# EAGLE design NeoDuino (EAGLE 9.1.0)
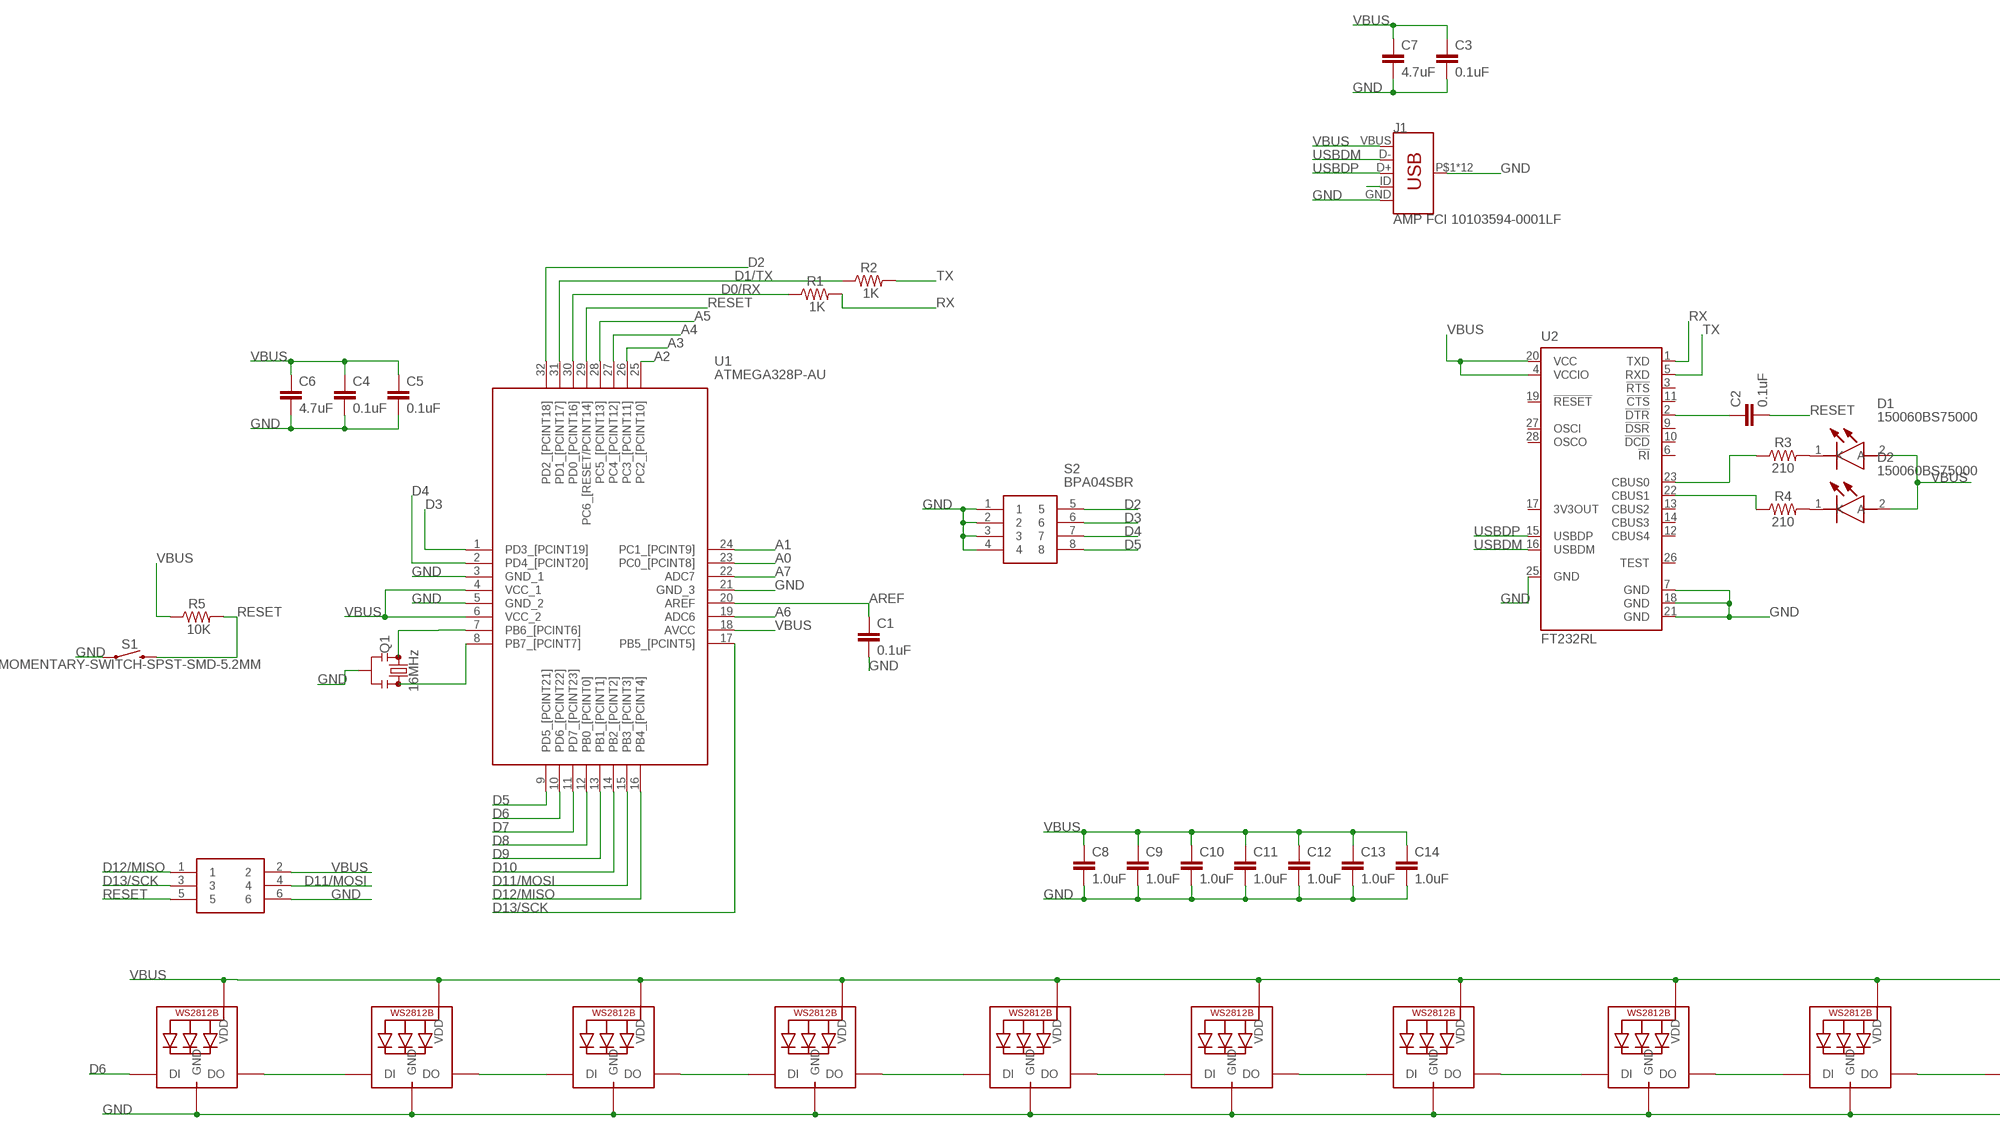
[diagram p0: schematic, sheet 1, part 1 of 2]
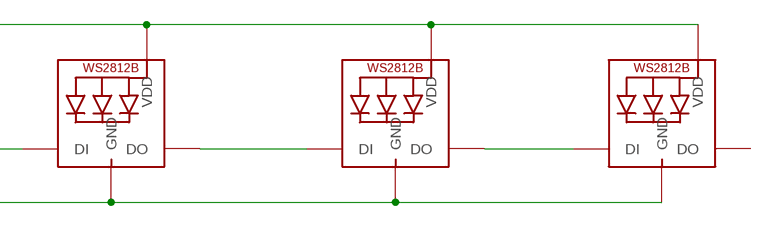
[diagram p1: schematic, sheet 1, part 2 of 2]

## Parts
C1  0.1uF  0.1UF-0402-16V-10%  [0402]
C2  0.1uF  0.1UF-0402-16V-10%  [0402]
C3  0.1uF  0.1UF-0402-16V-10%  [0402]
C4  0.1uF  0.1UF-0402-16V-10%  [0402]
C5  0.1uF  0.1UF-0402-16V-10%  [0402]
C6  4.7uF  4.7UF0603  [0603]
C7  4.7uF  4.7UF0603  [0603]
C8  1.0uF  1.0UF-0402-16V-10%  [0402]
C9  1.0uF  1.0UF-0402-16V-10%  [0402]
C10  1.0uF  1.0UF-0402-16V-10%  [0402]
C11  1.0uF  1.0UF-0402-16V-10%  [0402]
C12  1.0uF  1.0UF-0402-16V-10%  [0402]
C13  1.0uF  1.0UF-0402-16V-10%  [0402]
C14  1.0uF  1.0UF-0402-16V-10%  [0402]
D1  150060BS75000  [LEDC1608X80N]
D2  150060BS75000  [LEDC1608X80N]
D3  WS2812B5050  [WS2812B]
D4  WS2812B5050  [WS2812B]
D5  WS2812B5050  [WS2812B]
D6  WS2812B5050  [WS2812B]
D7  WS2812B5050  [WS2812B]
D8  WS2812B5050  [WS2812B]
D9  WS2812B5050  [WS2812B]
D10  WS2812B5050  [WS2812B]
D11  WS2812B5050  [WS2812B]
D12  WS2812B5050  [WS2812B]
D13  WS2812B5050  [WS2812B]
D14  WS2812B5050  [WS2812B]
J1  AMP FCI 10103594-0001LF  USB_MICRO-B_HALF_PTH  [USB-MICROB-PTH]
J2  TSM-103-01-L-DH  [TSM-103-01-L-DH]
Q1  16MHz  RESONATOR-16MHZSMD_3.2X1.3  [RESONATOR-SMD-3.2X1.3]
R1  1K  RESISTOR0402  [0402]
R2  1K  RESISTOR0402  [0402]
R3  210  RESISTOR0402  [0402]
R4  210  RESISTOR0402  [0402]
R5  10K  RESISTOR0402  [0402]
S1  MOMENTARY-SWITCH-SPST-SMD-5.2MM  [TACTILE_SWITCH_SMD_5.2MM]
S2  BPA04SBR  [BPA04SBR]
U1  ATMEGA328P-AU  [QFP80P900X900X120-32N]
U2  FT232RL  [SSOP28]

## Nets
A0: U1.23(PC0_[PCINT8])
A1: U1.24(PC1_[PCINT9])
A2: U1.25(PC2_[PCINT10])
A3: U1.26(PC3_[PCINT11])
A4: U1.27(PC4_[PCINT12])
A5: U1.28(PC5_[PCINT13])
A6: U1.19(ADC6)
A7: U1.22(ADC7)
AREF: C1.1 U1.20(AREF)
D0/RX: R1.1 U1.30(PD0_[PCINT16])
D1/TX: R2.1 U1.31(PD1_[PCINT17])
D2: S2.5 U1.32(PD2_[PCINT18])
D3: S2.6 U1.1(PD3_[PCINT19])
D4: S2.7 U1.2(PD4_[PCINT20])
D5: S2.8 U1.9(PD5_[PCINT21])
D6: D3.4-DIN(DI) U1.10(PD6_[PCINT22])
D7: U1.11(PD7_[PCINT23])
D8: U1.12(PB0_[PCINT0])
D9: U1.13(PB1_[PCINT1])
D10: U1.14(PB2_[PCINT2])
D11/MOSI: J2.4 U1.15(PB3_[PCINT3])
D12/MISO: J2.1 U1.16(PB4_[PCINT4])
D13/SCK: J2.3 U1.17(PB5_[PCINT5])
GND: C1.2 C3.2 C4.2 C5.2 C6.2 C7.2 C8.2 C9.2 C10.2 C11.2 C12.2 C13.2 C14.2 D3.3-GND(GND) D4.3-GND(GND) D5.3-GND(GND) D6.3-GND(GND) D7.3-GND(GND) D8.3-GND(GND) D9.3-GND(GND) D10.3-GND(GND) D11.3-GND(GND) D12.3-GND(GND) D13.3-GND(GND) D14.3-GND(GND) J1.GND J1.P$1(SHIELD) J1.P$2(SHIELD) J1.P$3(SHIELD) J1.P$4(SHIELD) J1.P$6(SHIELD) J1.P$8(SHIELD) J1.P$10(SHIELD) J1.P$12(SHIELD) J1.SHEILD2(SHIELD) J1.SHIELD J1.SHIELD3(SHIELD) J1.SHIELD4(SHIELD) J2.6 Q1.2 S1.1 S2.1 S2.2 S2.3 S2.4 U1.3(GND_1) U1.5(GND_2) U1.21(GND_3) U2.7(GND) U2.18(GND) U2.21(GND) U2.25(GND)
N$1: Q1.3 U1.8(PB7_[PCINT7])
N$2: C2.1 U2.2(!DTR)
N$3: R3.1 U2.23(CBUS0)
N$4: Q1.1 U1.7(PB6_[PCINT6])
N$5: J1.ID
N$6: D1.1(K) R3.2
N$7: D2.1(K) R4.2
N$9: R4.1 U2.22(CBUS1)
N$10: D5.2-DOUT(DO) D6.4-DIN(DI)
N$11: D4.2-DOUT(DO) D5.4-DIN(DI)
N$12: D3.2-DOUT(DO) D4.4-DIN(DI)
N$13: D8.2-DOUT(DO) D9.4-DIN(DI)
N$14: D11.2-DOUT(DO) D12.4-DIN(DI)
N$15: D7.2-DOUT(DO) D8.4-DIN(DI)
N$16: D6.2-DOUT(DO) D7.4-DIN(DI)
N$17: D10.2-DOUT(DO) D11.4-DIN(DI)
N$18: D9.2-DOUT(DO) D10.4-DIN(DI)
N$19: D13.2-DOUT(DO) D14.4-DIN(DI)
N$20: D12.2-DOUT(DO) D13.4-DIN(DI)
RESET: C2.2 J2.5 R5.2 S1.3 U1.29(PC6_[RESET/PCINT14])
RX: R1.2 U2.1(TXD)
TX: R2.2 U2.5(RXD)
USBDM: J1.D- U2.16(USBDM)
USBDP: J1.D+ U2.15(USBDP)
VBUS: C3.1 C4.1 C5.1 C6.1 C7.1 C8.1 C9.1 C10.1 C11.1 C12.1 C13.1 C14.1 D1.2(A) D2.2(A) D3.1-VDD(VDD) D4.1-VDD(VDD) D5.1-VDD(VDD) D6.1-VDD(VDD) D7.1-VDD(VDD) D8.1-VDD(VDD) D9.1-VDD(VDD) D10.1-VDD(VDD) D11.1-VDD(VDD) D12.1-VDD(VDD) D13.1-VDD(VDD) D14.1-VDD(VDD) J1.VBUS J2.2 R5.1 U1.4(VCC_1) U1.6(VCC_2) U1.18(AVCC) U2.4(VCCIO) U2.20(VCC)
Unconnected: D14.2-DOUT(DO) U2.3(!RTS) U2.6(!RI) U2.9(!DSR) U2.10(!DCD) U2.11(!CTS) U2.12(CBUS4) U2.13(CBUS2) U2.14(CBUS3) U2.17(3V3OUT) U2.19(!RESET) U2.26(TEST) U2.27(OSCI) U2.28(OSCO)

## Library data of the parts
C1-C5 = SparkFun-Capacitors:0.1UF: 0.1µF ceramic capacitors A capacitor is a passive two-terminal electrical component used to store electrical energy temporarily in an electric field.; PROD_ID: CAP-12416
C6 C7 = SparkFun-Capacitors:4.7UF: 4.7µF ceramic capacitors A capacitor is a passive two-terminal electrical component used to store electrical energy temporarily in an electric field.; PROD_ID: CAP-08280
C8-C14 = SparkFun-Capacitors:1.0UF: 1µF ceramic capacitors A capacitor is a passive two-terminal electrical component used to store electrical energy temporarily in an electric field.; PROD_ID: CAP-12417
D1 D2 = MitchellLibrary:150060BS75000: LED,Wurth Elektronik,150060BS75000 Wurth Elektronik 150060BS75000, WL-SMCW Series Blue LED, 470 nm 1608 (0603) Clear, Rectangle Lens SMD package Source: Datasheet <https://componentsearchengine.com/Datasheets/2/150060BS75000.pdf>; ARROW_PART_NUMBER: 150060BS75000; ARROW_PRICE-STOCK: http://uk.rs-online.com/web/p/products/1623738; DESCRIPTION: LED,Wurth Elektronik,150060BS75000 Wurth Elektronik 150060BS75000, WL-SMCW Series Blue LED, 470 nm 1608 (0603) Clear, Rectangle Lens SMD package; HEIGHT: 0.8mm; MANUFACTURER_NAME: Wurth Elektronik; MANUFACTURER_PART_NUMBER: 150060BS75000; RS_PART_NUMBER: 1623738; RS_PRICE-STOCK: http://uk.rs-online.com/web/p/products/1623738
D3-D14 = adafruit:WS2812B
J1 = SparkFun-Connectors:USB_MICRO-B: USB Type Micro-B Connector Male/female and PTH/SMT variants SparkFun Products: SparkFun microB USB Breakout <https://www.sparkfun.com/products/12035> SparkFun USB microB Plug Breakout <https://www.sparkfun.com/products/10031> SparkFun ESP8266 Thing <https://www.sparkfun.com/products/13231>; PROD_ID: CONN-13711
J2 = MitchellLibrary:TSM-103-01-L-DH
Q1 = SparkFun-Clocks:RESONATOR-16MHZ: 16MHz Resonator Digikey Example <http://www.digikey.com/product-detail/en/murata-electronics-north-america/CSTCE16M0V53-R0/490-1198-1-ND/584635> Frequency: 16MHz Frequency Stability: ±0.3% Frequency Tolerance: ±0.5% Capacitance: 15pF SparkFun Products SparkFun OpenLog <https://www.sparkfun.com/products/13712> SparkFun MicroView - OLED Arduino Module <https://www.sparkfun.com/products/12923>; PROD_ID: XTAL-08900
R1-R5 = SparkFun-Resistors:RESISTOR: Generic Resistor Package
S1 = SparkFun-Switches:MOMENTARY-SWITCH-SPST: Momentary Switch (Pushbutton) - SPST Normally-open (NO) SPST momentary switches (buttons, pushbuttons). Variants PTH-12MM - 12mm square, through-hole Momentary Pushbutton Switch - 12mm Square <https://www.sparkfun.com/products/9190> (COM-09190) PTH-6.0MM, PTH-6.0MM-KIT - 6.0mm square, through-hole Mini Pushbutton Switch <https://www.sparkfun.com/products/97> (COM-00097) KIT package intended for soldering kit's - only one side of pads' copper is exposed. PTH-RIGHT-ANGLE-KIT - Right-angle, through-hole Right Angle Tactile Button <https://www.sparkfun.com/products/10791> - Used on SparkFun BigTime Watch Kit <https://www.sparkfun.com/products/11734> SMD-12MM - 12mm square, surface-mount Tactile Button - SMD (12mm) <https://www.sparkfun.com/products/12993> (COM-12993) Used on SparkFun PicoBoard <https://www.sparkfun.com/products/11888> SMD-4.5MM - 4.5mm Square Trackball Switch Used on SparkFun Blackberry Trackballer Breakout <https://www.sparkfun.com/products/13169> SMD-4.6MMX2.8MM - 4.60mm x 2.80mm, surface mount Used on SparkFun SAMD21 Mini Breakout <https://www.sparkfun.com/products/13664> SMD-5.2MM, SMD-5.2-REDUNDANT - 5.2mm square, surface-mount Mini Pushbutton Switch - SMD <https://www.sparkfun.com/products/8720> (COM-08720) Used on Arduino Pro Mini <https://www.sparkfun.com/products/11114> REDUNDANT package connects both switch circuits together SMD-6.0X3.5MM - 6.0 x 3.5mm, surface mount Momentary Reset Switch SMD <https://www.sparkfun.com/products/8229> (COM-08229) SMD-6.2MM-TALL - 6.2mm square, surface mount Tactile Button - SMD (6mm) <https://www.sparkfun.com/products/12992> Used on SparkFun Digital Sandbox <https://www.sparkfun.com/products/12651> SMD-RIGHT-ANGLE - Right-angle, surface mount Used on SparkFun Block for Intel® Edison - Arduino <https://www.sparkfun.com/products/13036>; PROD_ID: SWCH-08247; SF_SKU: COM-08720
S2 = MitchellLibrary:BPA04SBR: 4 Way Surface Mount DIP Switch SPST, Side Actuator Source: Datasheet <https://www.ckswitches.com/media/1332/bpa.pdf>; ARROW_PART_NUMBER: BPA04SBR; ARROW_PRICE-STOCK: https://www.arrow.com/en/products/bpa04sbr/ck; DESCRIPTION: 4 Way Surface Mount DIP Switch SPST, Side Actuator; HEIGHT: 7mm; MANUFACTURER_NAME: C & K COMPONENTS; MANUFACTURER_PART_NUMBER: BPA04SBR; RS_PART_NUMBER: 7931557P; RS_PRICE-STOCK: http://uk.rs-online.com/web/p/products/7931557P
U1 = MitchellLibrary:ATMEGA328P-AU: MICROCHIP - ATMEGA328P-AU. - MICROCONTROLLER MCU, 8 BIT, ATMEGA, 20MHZ, TQFP-32 Source: Datasheet <https://componentsearchengine.com/Datasheets/2/ATMEGA328P-AU.pdf>; ARROW_PART_NUMBER: ATMEGA328P-AU; ARROW_PRICE-STOCK: https://www.arrow.com/en/products/atmega328p-au/microchip-technology; DESCRIPTION: MICROCHIP - ATMEGA328P-AU. - MICROCONTROLLER MCU, 8 BIT, ATMEGA, 20MHZ, TQFP-32; HEIGHT: 1.2mm; MANUFACTURER_NAME: Microchip; MANUFACTURER_PART_NUMBER: ATMEGA328P-AU; RS_PART_NUMBER: 1310271; RS_PRICE-STOCK: http://uk.rs-online.com/web/p/products/1310271
U2 = ftdichip:FT232R: Source: http://www.ftdichip.com/Documents/DataSheets/DS_FT232R_v104.pdf; MPN: FT232RL; OC_FARNELL: 1146032; OC_NEWARK: 91K9918

## Board
PCB Matrix Packages
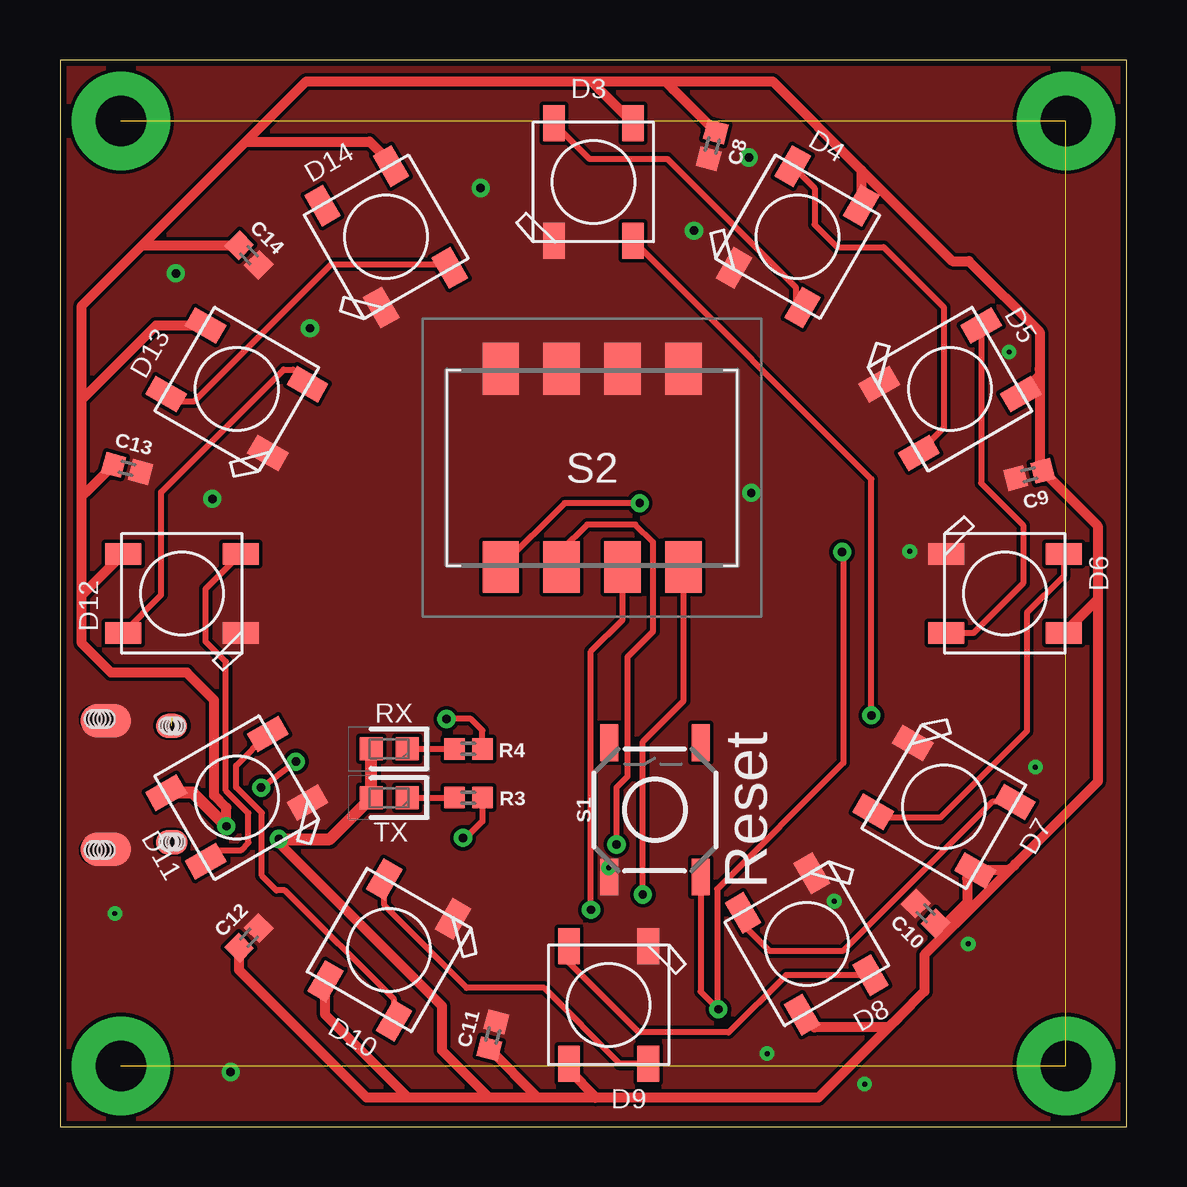
[diagram p2: board, top side]
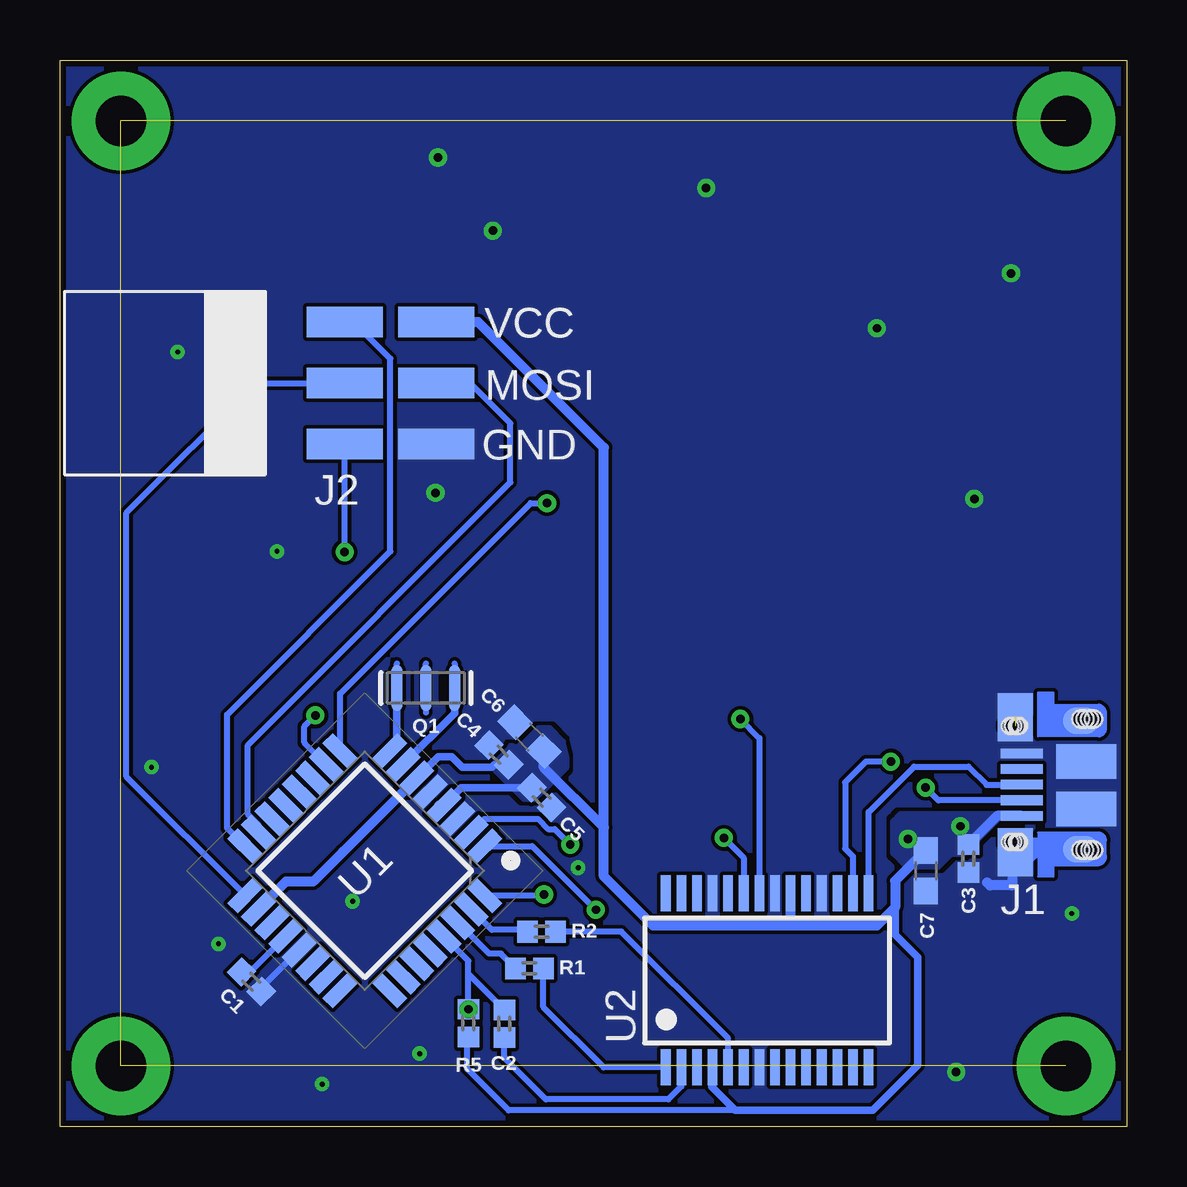
[diagram p3: board, bottom side, seen from below]

Size 44.45 x 44.45 mm. Coordinates in mm from the lower left corner, seen from the top.
Outline: 0,0 44.45,0 44.45,44.45 0,44.45 0,0
Copper layers (1*16): Top 0.035mm / dielectric 1.5mm / Bottom 0.035mm
Design rules "default *": minimum track width 6mil, minimum drill 0.35mm, track to track 6mil, track to pad 6mil, pad to pad 6mil, via to via 6mil, smd to smd 6mil, copper to edge 10mil, drill to drill 6mil, minimum pad ring 10mil, minimum via ring 8mil, stop-mask expansion 4mil, vias tented up to drill 0mil, thermal gap 10mil

### Footprints (pad centres in the part's own frame; a part is rotated, then mirrored left to right if it is on the bottom)
0402 = smd 0.85 x 0.9: 1 -0.58,0; 2 0.58,0
0603 = smd 1.1 x 1: 1 -0.85,0; 2 0.85,0
LEDC1608X80N = smd 0.95 x 0.95: 1 -0.75,0; 2 0.75,0
WS2812B = smd 1.5 x 0.9: 1-VDD 2.45,-1.65; 2-DOUT 2.45,1.65; 3-GND -2.45,1.65; 4-DIN -2.45,-1.65
USB-MICROB-PTH = smd 0.4 x 1.75: D+ 0.031,1.331; D- -0.619,1.331; GND 1.331,1.331; ID 0.681,1.331; VBUS -1.269,1.331 | smd 1.4 x 2.1 bottom: P$1 2.701,-1.142; P$3 -2.659,-1.144 | smd 1 x 1.3: P$2 2.487,1.594; P$6 -2.368,1.604 | smd 1 x 1.3 bottom: P$4 -2.368,1.604; P$10 2.481,1.598 | smd 1.1 x 1.5: P$8 2.701,-1.142; P$12 -2.659,-1.144 | smd 2 x 1.46: SHEILD2 2.831,1.606; SHIELD -2.794,1.606 | smd 1.425 x 2.5: SHIELD3 -0.979,-1.349; SHIELD4 0.996,-1.352 | hole 0.7: -2.693,-1.134; -2.693,-1.3; -2.694,-1.499; -2.694,-1.664; 2.768,-1.134; 2.767,-1.303; 2.766,-1.496; 2.766,-1.664 | hole 0.66: -2.359,1.821; -2.349,1.691; -2.359,1.541; -2.354,1.432; 2.481,1.821; 2.491,1.691; 2.481,1.541; 2.486,1.432
TSM-103-01-L-DH = smd 1.27 x 3.175: 1 0,0; 2 0,3.81; 3 2.54,0; 4 2.54,3.81; 5 5.08,0; 6 5.08,3.81
RESONATOR-SMD-3.2X1.3 = smd 0.45 x 1.905: 1 -1.2,0; 2 0,0; 3 1.2,0
TACTILE_SWITCH_SMD_5.2MM = smd 1.524 x 0.762: 1 -2.794,1.905; 2 2.794,1.905; 3 -2.794,-1.905; 4 2.794,-1.905
BPA04SBR = smd 1.52 x 2.15: 1 -3.81,-4.13; 2 -1.27,-4.13; 3 1.27,-4.13; 4 3.81,-4.13; 5 -3.81,4.13; 6 -1.27,4.13; 7 1.27,4.13; 8 3.81,4.13
QFP80P900X900X120-32N = smd 1.5 x 0.6: 1 -4.25,2.8; 2 -4.25,2; 3 -4.25,1.2; 4 -4.25,0.4; 5 -4.25,-0.4; 6 -4.25,-1.2; 7 -4.25,-2; 8 -4.25,-2.8; 17 4.25,-2.8; 18 4.25,-2; 19 4.25,-1.2; 20 4.25,-0.4; 21 4.25,0.4; 22 4.25,1.2; 23 4.25,2; 24 4.25,2.8 | smd 0.6 x 1.5: 9 -2.8,-4.25; 10 -2,-4.25; 11 -1.2,-4.25; 12 -0.4,-4.25; 13 0.4,-4.25; 14 1.2,-4.25; 15 2,-4.25; 16 2.8,-4.25; 25 2.8,4.25; 26 2,4.25; 27 1.2,4.25; 28 0.4,4.25; 29 -0.4,4.25; 30 -1.2,4.25; 31 -2,4.25; 32 -2.8,4.25
SSOP28 = smd 0.4 x 1.5: 1 -4.225,-3.625; 2 -3.575,-3.625; 3 -2.925,-3.625; 4 -2.275,-3.625; 5 -1.625,-3.625; 6 -0.975,-3.625; 7 -0.325,-3.625; 8 0.325,-3.625; 9 0.975,-3.625; 10 1.625,-3.625; 11 2.275,-3.625; 12 2.925,-3.625; 13 3.575,-3.625; 14 4.225,-3.625; 15 4.225,3.625; 16 3.575,3.625; 17 2.925,3.625; 18 2.275,3.625; 19 1.625,3.625; 20 0.975,3.625; 21 0.325,3.625; 22 -0.325,3.625; 23 -0.975,3.625; 24 -1.625,3.625; 25 -2.275,3.625; 26 -2.925,3.625; 27 -3.575,3.625; 28 -4.225,3.625

### Placement (x,y rotation side)
C1  36.47,6.05 315 bottom
C2  25.93,4.29 90 bottom
C3  6.6,11.18 270 bottom
C4  26.16,15.49 135 bottom
C5  24.38,13.72 315 bottom
C6  24.89,16.26 135 bottom
C7  8.38,10.67 270 bottom
C8  27.18,40.89 255 top
C9  40.39,27.18 195 top
C10  36.07,8.89 135 top
C11  18.03,3.81 75 top
C12  7.87,7.87 45 top
C13  2.79,27.43 345 top
C14  7.87,36.32 315 top
D1  13.72,13.72 180 top
D2  13.72,15.75 180 top
D3  22.23,39.37 90 top
D4  30.73,37.08 60 top
D5  37.08,30.73 30 top
D6  39.37,22.23 0 top
D7  36.83,13.34 330 top
D8  31.11,7.62 300 top
D9  22.86,5.08 270 top
D10  13.72,7.37 240 top
D11  7.37,13.72 210 top
D12  5.08,22.23 180 top
D13  7.37,30.73 150 top
D14  13.59,37.08 120 top
J1  3.05,14.22 90 bottom
J2  32.59,33.53 270 bottom
Q1  29.21,18.29 180 bottom
R1  24.89,6.6 0 bottom
R2  24.38,8.13 0 bottom
R3  17.02,13.72 180 top
R4  17.02,15.75 180 top
R5  27.43,4.32 90 bottom
S1  24.79,13.21 90 top
S2  22.17,27.46 180 top
U1  31.75,10.67 225 bottom
U2  14.99,6.1 0 bottom

### Tracks (layer width: path | path; a pad name or v marks a point on that pad's centre or on a via)
AREF
  Bottom 0.254: C1.1 36.53,6.46 U1.20
D0/RX
  Bottom 0.254: R1.1 26.08,7.21 26.57,7.21 27.87,8.51 U1.30
D1/TX
  Bottom 0.254: R2.1 25.04,8.2 26.46,8.2 U1.31
D2  (via drill 0.35)
  Top 0.254: v24.28,9.68 24.28,16.05 25.98,17.75 S2.5
  Bottom 0.254: U1.32 24.32,9.64 v24.28,9.68
D3  (via drill 0.35)
  Top 0.254: v22.12,9.04 22.12,19.81 23.44,21.13 S2.6
  Bottom 0.254: U1.1 24.77,11.69 v22.12,9.04
D4  (via drill 0.35)
  Top 0.254: v23.19,11.76 23.19,14.15 23.65,14.61 23.65,19.58 24.71,20.65 24.71,24.36 23.98,25.09 21.96,25.09 20.9,24.04 S2.7
  Bottom 0.254: U1.2 26.76,12.83 24.53,12.83 24.11,12.41 23.84,12.41 v23.19,11.76
D5  (via drill 0.35)
  Top 0.254: v24.16,25.98 21.02,25.98 S2.8
  Bottom 0.254: U1.9 32.77,18.05 24.84,25.98 v24.16,25.98
D6  (via drill 0.35)
  Top 0.254: v33.81,17.14 33.81,26.99 D3.4-DIN
  Bottom 0.254: U1.10 34.27,16.01 34.27,16.69 v33.81,17.14
D11/MOSI
  Bottom 0.254: U1.15 36.17,12.57 36.63,13.03 36.63,15.9 25.68,26.85 25.68,29.31 27.36,30.99 J2.4
D12/MISO
  Bottom 0.254: U1.16 37.49,12.45 37.49,17.17 30.68,23.98 30.68,32 32.21,33.53 J2.1
D13/SCK
  Bottom 0.254: U1.17 41.68,14.59 41.68,25.58 36.27,30.99 J2.3
GND  (via drill 0.2 pad 0.41, 0.35)  (3 unrouted)
  Bottom 0.254: C1.2 36.06,5.79 U1.21
  Bottom 0.406: J1.P$6 3.51,11.86 3.38,11.99 3.69,11.67 3.69,11.54 4.16,11.08 4.29,11.08 4.78,10.59 4.78,10.06 5.69,10.06 5.82,10.19
  other vias: 28.8,26.42 26.42,37.34 28.7,40.39 17.53,39.12 10.41,33.27 6.35,26.16 4.83,35.56 2.29,8.89 7.11,2.29 29.46,3.05 33.53,1.78 37.85,7.62 32.26,9.4 40.64,14.99 35.41,23.98 39.55,32.28 22.86,10.79
  pour Bottom (rank 2, no thermals): 0,0 0,44.45 44.45,44.45 44.45,0
  pour Top (rank 2, no thermals): 0,0 0,44.2 0.25,44.45 44.45,44.45 44.45,0 37.85,0 37.59,-0.25
N$1
  Bottom 0.305: Q1.3 30.41,15.97 U1.8
N$2
  Bottom 0.254: U2.2 18.56,1.68 19.1,1.14 24.21,1.14 25.96,2.9 25.93,2.92 C2.1
N$3  (via drill 0.35)
  Top 0.254: R3.1 17.6,12.73 17.6,12.72 16.92,12.04 v16.79,12.04
  Bottom 0.254: v16.79,12.04 15.96,11.21 U2.23
N$4
  Bottom 0.305: Q1.1 28.01,17.24 U1.7
N$6
  Top 0.254: D1.1 R3.2
N$7
  Top 0.254: D2.1 R4.2
N$8  (via drill 2.1 pad 4.1)  (3 unrouted)
  other vias: 2.54,2.54 41.91,2.54 41.91,41.91 2.54,41.91
N$9  (via drill 0.35)
  Top 0.254: 17.62,15.77 R4.1 17.6,16.51 17.12,16.99 v16.1,16.99
  Bottom 0.254: v16.1,16.99 15.31,16.2 U2.22
N$10
  Top 0.254: D5.2-DOUT 38.38,26.82 40.13,25.07 40.13,22.66 38.05,20.57 D6.4-DIN
N$11
  Top 0.254: D4.2-DOUT 31.45,39.12 31.45,37.59 32.38,36.65 34.31,36.65 36.83,34.14 36.83,29.12 D5.4-DIN
N$12
  Top 0.254: D3.2-DOUT 22.06,40.34 25.3,40.34 30.66,34.98 30.66,34.42 D4.4-DIN
N$13
  Top 0.254: D8.2-DOUT 30.25,6.32 27.86,3.94 24.11,3.94 21.21,6.83 D9.4-DIN
N$14
  Top 0.254: D11.2-DOUT 6.54,11.53 7.54,11.53 7.85,11.84 7.85,13.06 6.91,14.01 6.91,19.38 6.07,20.22 6.07,22.42 D12.4-DIN
N$15
  Top 0.254: D7.2-DOUT 38.84,13.54 32.61,7.32 29.57,7.32 28.46,8.42 D8.4-DIN
N$16
  Top 0.254: D6.2-DOUT 41.82,22.95 40.28,21.41 40.28,16.48 36.68,12.88 34.14,12.88 D7.4-DIN
N$17
  Top 0.254: D10.2-DOUT 13.92,5.31 9.37,9.86 9.02,9.86 8.41,10.46 8.41,13.08 7.34,14.15 7.34,15.05 D11.4-DIN
N$18
  Top 0.254: D9.2-DOUT 23.33,2.63 20.17,5.79 16.94,5.79 13.51,9.22 D10.4-DIN
N$19
  Top 0.254: D14.4-DIN 16.09,35.94 11.3,35.94 5.59,30.23 4.72,30.23 D13.2-DOUT
N$20
  Top 0.254: D12.2-DOUT 4.22,22.16 4.22,26.44 9.32,31.55 9.7,31.55 D13.4-DIN
RESET  (via drill 0.35)
  Top 0.254: S1.3 26.7,5.63 R5.2 27.38,4.95 27.38,9.91 32.64,15.16 32.64,23.9 v32.59,23.95
  Bottom 0.254: R5.2 27.43,6.92 | 27.43,6.92 U1.29 | C2.2 27.43,6.37 27.43,6.92 | v32.59,23.95 J2.5
  other vias: 27.43,4.9
RX
  Bottom 0.254: U2.1 21.8,2.47 24.31,4.98 R1.2
TX
  Bottom 0.254: U2.5 16.61,3.68 21.06,8.13 R2.2
USBDM  (via drill 0.35)
  Top 0.254: v8.38,14.13 v8.39,14.13 v9.83,15.21
  Bottom 0.254: U2.16 11.41,11.27 11.73,11.6 11.73,14.35 10.87,15.21 v9.83,15.21 | J1.D- 7.86,13.61 v8.38,14.13
USBDP
  Bottom 0.254: U2.15 10.76,13.12 8.87,15.01 6.6,15.01 5.84,14.25 J1.D+
VBUS  (via drill 0.35)
  Top 0.406: v6.93,12.52 6.93,13.3 6.43,13.8 6.43,17.78 5.28,18.92 2.13,18.92 0.91,20.14 0.91,22.16 | D12.1-VDD 1.22,22.46 0.94,22.18 0.91,22.16 | D14.1-VDD 13.79,40.16 12.9,41.05 7.75,41.05 | D3.1-VDD 22.46,43.23 22.13,43.56 | 22.13,43.56 25.22,43.56 | C8.1 25.55,43.23 25.22,43.56 | 25.22,43.56 29.69,43.56 33.39,39.87 | 33.39,39.87 D4.1-VDD | 33.39,39.87 37.19,36.07 37.87,36.07 40.82,33.12 40.82,31.57 | D5.1-VDD 40.82,31.32 40.82,31.57 | 40.82,31.57 40.82,27.46 C9.1 43.23,25.04 43.23,21.99 | 43.23,21.99 D6.1-VDD | 43.23,21.99 43.23,14.38 39.8,10.95 | 39.8,10.95 39.53,10.68 D7.1-VDD 37.8,10.35 37.8,9.35 36.93,8.48 C10.1 37.33,8.48 39.8,10.95 | 39.8,10.95 36.02,7.16 36.02,5.64 34.95,4.57 | 34.95,4.57 34.52,4.14 31.44,4.14 D8.1-VDD | 34.95,4.57 31.6,1.22 22.35,1.22 | 22.35,1.22 22.25,1.22 22.35,1.22 | 22.35,1.22 21.21,2.36 D9.1-VDD | 22.35,1.22 20.9,1.22 | 20.9,1.22 19.91,1.22 C11.1 | 20.9,1.22 17.88,1.22 | 17.88,1.22 15.37,1.22 | 15.37,1.22 14.5,1.22 11.93,3.8 11.06,4.66 D10.1-VDD | 15.37,1.22 12.78,1.22 7.46,6.53 C12.1 | 17.88,1.22 15.93,3.17 15.93,5.03 9.12,11.84 v9.12,11.99 | 0.91,22.16 0.91,26.26 | C13.1 1.22,26.57 0.91,26.26 | 0.91,26.26 0.91,30.3 | 0.91,30.3 0.91,34.21 3.43,36.73 | 3.43,36.73 7.75,41.05 | 7.75,41.05 10.26,43.56 22.13,43.56 | D13.1-VDD 4,33.39 1.22,30.61 0.94,30.33 0.91,30.3 | 3.43,36.73 C14.1
  Top 0.508: v6.93,12.52 5.54,13.92 D11.1-VDD | v9.12,11.99 11.24,11.99 D1.2 D2.2
  Bottom 0.254: 16.31,0.69 25.76,0.69 27.48,2.41 27.48,3.69 R5.1
  Bottom 0.305: C5.1 27.73,14.13 U1.4 | C4.1 26.36,15.08 26.46,14.98 27.68,14.98 28.12,15.42 28.7,15.42 U1.6 | 9.65,9.14 9.65,8 8.71,7.06 8.71,2.56 10.59,0.69 16.31,0.69 16.33,0.71 16.79,1.17 17.3,1.68 17.26,1.71 U2.4
  Bottom 0.406: J1.VBUS 5.41,12.96 C3.1 | C7.1 9.65,10.25 9.65,9.14 10.41,8.38 13.72,8.38 | U2.20 14.01,8.68 13.72,8.38 | 13.72,8.38 19.74,8.38 21.79,10.44 21.79,12.47 | 21.79,12.47 24.29,14.97 C6.1 | U1.6 32.65,11.47 | 32.65,11.47 33.9,10.21 35.04,10.21 U1.18 | U1.4 28.67,13.39 | 32.58,11.53 32.65,11.47 | 21.79,12.47 21.79,28.3 27.03,33.53 J2.2
  pour Bottom (no thermals): 5.33,12.95 6.86,11.43 7.37,11.43 7.87,10.92 9.14,10.92 9.65,11.43 9.65,12.7 9.4,12.95 8.64,12.95
  pour Bottom (no thermals): 23.5,16.05 24.05,16.61 24.38,16.61 24.51,16.61 25.2,15.93 25.63,15.93 25.83,15.72 26.29,15.27 26.29,14.91 26.29,14.83 25.12,13.67 24.66,13.67 24.36,13.97 23.34,14.99 23.34,15.37

### Text on the board
tPlace: RX | Reset | TX
bPlace: VCC | MOSI | GND